# EAGLE design rx20 (EAGLE 9.1.3)
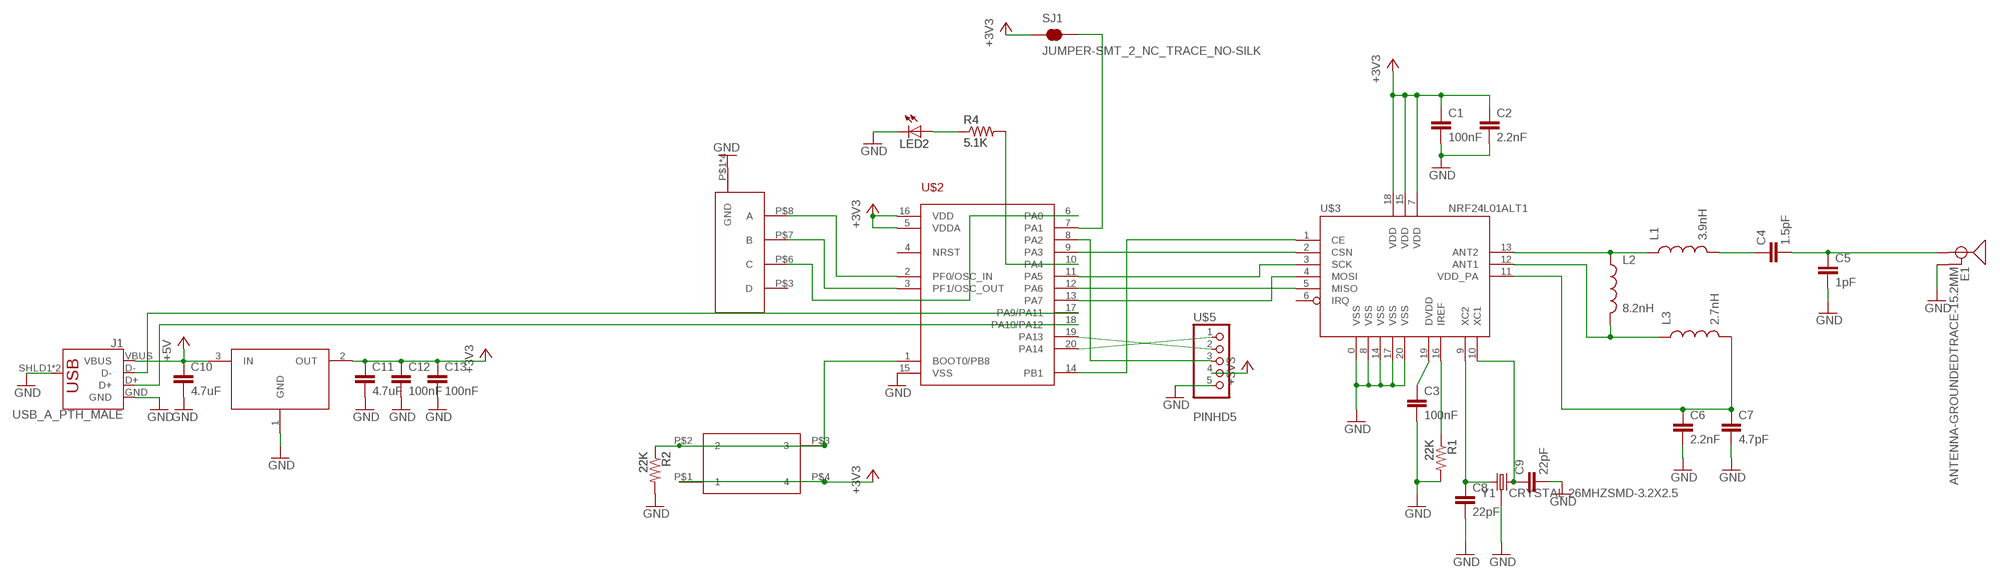
[diagram p0: schematic, sheet 1]

## Parts
C1  100nF  CAP0805  [0805]
C2  2.2nF  CAP0805  [0805]
C3  100nF  CAP0805  [0805]
C4  1.5pF  CAP0805  [0805]
C5  1pF  CAP0805  [0805]
C6  2.2nF  CAP0805  [0805]
C7  4.7pF  CAP0805  [0805]
C8  22pF  CAP0805  [0805]
C9  22pF  CAP0805  [0805]
C10  4.7uF  CAP0805  [0805]
C11  4.7uF  CAP0805  [0805]
C12  100nF  CAP0805  [0805]
C13  100nF  CAP0805  [0805]
E1  ANTENNA-GROUNDEDTRACE-15.2MM  [TRACE_ANTENNA_2.4GHZ_15.2MM]
J1  USB_A_PTH_MALE  [USB-A-H]
L1  3.9nH  INDUCTOR0805  [0805]
L2  8.2nH  INDUCTOR0805  [0805]
L3  2.7nH  INDUCTOR0805  [0805]
LED2  LEDCHIP-LED0805  [CHIP-LED0805]
R1  22K  RESISTOR0805-RES  [0805]
R2  22K  RESISTOR0805-RES  [0805]
R4  5.1K  RESISTOR0805-RES  [0805]
SJ1  JUMPER-SMT_2_NC_TRACE_NO-SILK  [SMT-JUMPER_2_NC_TRACE_NO-SILK]
U$1  SW_3POS_DEVSW_3POS_OFFICIAL  [SW_3POS_FOOT_OFFICIAL]
U$2  STM32F042F4  [TSSOP20]
U$3  NRF24L01ALT1  [QFN20_ALT1]
U$4  XC6206_DEV  [SOT23R_INFINEON]
U$5  PINHD5  [1X05]
U$10  324_SW  [342_SWICH_FOOT]
Y1  CRYSTAL-26MHZSMD-3.2X2.5  [CRYSTAL-SMD-3.2X2.5MM]

## Nets
+3V3: C1.1 C2.1 C11.1 C12.1 C13.1 SJ1.1 U$2.5(VDDA) U$2.16(VDD) U$3.7(VDD) U$3.15(VDD) U$3.18(VDD) U$4.2(OUT) U$5.4 U$10.P$1 U$10.P$4
+5V: C10.1 J1.VBUS U$4.3(IN)
GND: C1.2 C2.2 C3.2 C5.2 C6.2 C7.2 C8.2 C9.2 C10.2 C11.2 C12.2 C13.2 E1.GND J1.GND J1.SHLD1(SHIELD) J1.SHLD2(SHIELD) LED2.C R1.2 R2.2 U$1.P$1(GND) U$1.P$2(GND) U$1.P$4(GND) U$1.P$5(GND) U$2.15(VSS) U$3.0(VSS) U$3.8(VSS) U$3.14(VSS) U$3.17(VSS) U$3.20(VSS) U$4.1(GND) U$5.5 Y1.2 Y1.4
N$1: C3.1 U$3.19(DVDD)
N$2: R1.1 U$3.16(IREF)
N$3: L1.1 L2.1 U$3.13(ANT2)
N$4: C4.1 L1.2
N$5: C4.2 C5.1 E1.ANT(SIGNAL)
N$6: L2.2 L3.1 U$3.12(ANT1)
N$7: C8.1 U$3.9(XC2) Y1.1
N$8: C6.1 C7.1 L3.2 U$3.11(VDD_PA)
N$9: C9.1 U$3.10(XC1) Y1.3
N$10: U$1.P$8(A) U$2.2(PF0/OSC_IN)
N$11: R2.1 U$2.1(BOOT0/PB8) U$10.P$2 U$10.P$3
N$12: J1.D- U$2.17(PA9/PA11)
N$13: J1.D+ U$2.18(PA10/PA12)
N$14: U$2.12(PA6) U$3.5(MISO)
N$15: U$2.13(PA7) U$3.4(MOSI)
N$16: U$2.11(PA5) U$3.3(SCK)
N$17: U$2.19(PA13) U$5.2
N$18: LED2.A R4.1
N$19: SJ1.2 U$2.7(PA1)
N$20: U$2.20(PA14) U$5.1
N$21: U$2.8(PA2) U$5.3
N$22: U$2.14(PB1) U$3.1(CE)
N$23: R4.2 U$2.10(PA4)
N$24: U$2.9(PA3) U$3.2(CSN)
N$25: U$1.P$7(B) U$2.3(PF1/OSC_OUT)
N$26: U$1.P$6(C) U$2.6(PA0)
Unconnected: U$1.P$3(D) U$2.4(NRST) U$3.6(IRQ)

## Library data of the parts
C1-C13 = clock:CAP: Capacitor Standard 0603 ceramic capacitor, and 0.1" leaded capacitor.
E1 = SparkFun-RF:ANTENNA-GROUNDED: Antenna w/ Ground Connection 2.4GHz antennae with signal and ground terminals. TRACE_ANTENNA_2.4GHZ_15.2MM - Meander Trace antenna 15.2 x 5.7mm footprint Based on layout from TI app note AN043 <http://www.ti.com/lit/an/swra117d/swra117d.pdf>. TRACE_ANTENNA_2.4GHZ_25.7MM - Inverted F trace antenna 25.7 x 7.5 mm footprint. Based on layout from TI design note DN0007 <http://www.ti.com/lit/an/swru120b/swru120b.pdf>.
J1 = rx20:USB_A: USB-A Connector Male and female variants, as well as PTH and SMT variants SparkFun Products: SparkFun XBee Explorer Dongle <https://www.sparkfun.com/products/11697> PTH Male SparkFun MicroView-USB Programmer <https://www.sparkfun.com/products/12924> SMT Male SparkFun USB Type A Female Breakout <https://www.sparkfun.com/products/12700> SMT Female; PROD_ID: CONN-08367; SF_ID: PRT-00437
L1-L3 = basicBoard:INDUCTOR: Inductors Basic Inductor/Choke - 0603 and 1206. Footprints are not proven and vary greatly between part numbers. INDUCTOR POWER 3.3UH 4.0A SMD 0.197" L x 0.197" W x 0.177" H (5.00mm x 5.00mm x 4.50mm)
LED2 = joyAnalog:LED: LED OSRAM: - CHIPLED LG R971, LG N971, LY N971, LG Q971, LY Q971, LO R971, LY R971 LH N974, LH R974 LS Q976, LO Q976, LY Q976 LO Q996 - Hyper CHIPLED LW Q18S LB Q993, LB Q99A, LB R99A - SideLED LS A670, LO A670, LY A670, LG A670, LP A670 LB A673, LV A673, LT A673, LW A673 LH A674 LY A675 LS A676, LA A676, LO A676, LY A676, LW A676 LS A679, LY A679, LG A679 - Hyper Micro SIDELED® LS Y876, LA Y876, LO Y876, LY Y876 LT Y87S - SmartLED LW L88C, LW L88S LB L89C, LB L89S, LG L890 LS L89K, LO L89K, LY L89K LS L896, LA L896, LO L896, LY L896 - TOPLED LS T670, LO T670, LY T670, LG T670, LP T670 LSG T670, LSP T670, LSY T670, LOP T670, LYG T670 LG T671, LOG T671, LSG T671 LB T673, LV T673, LT T673, LW T673 LH T674 LS T676, LA T676, LO T676, LY T676, LB T676, LH T676, LSB T676, LW T676 LB T67C, LV T67C, LT T67C, LS T67K, LO T67K, LY T67K, LW E67C LS E67B, LA E67B, LO E67B, LY E67B, LB E67C, LV E67C, LT E67C LW T67C LS T679, LY T679, LG T679 LS T770, LO T770, LY T770, LG T770, LP T770 LB T773, LV T773, LT T773, LW T773 LH T774 LS E675, LA E675, LY E675, LS T675 LS T776, LA T776, LO T776, LY T776, LB T776 LHGB T686 LT T68C, LB T68C - Hyper Mini TOPLED® LB M676 - Mini TOPLED Santana® LG M470 LS M47K, LO M47K, LY M47K Source: http://www.osram.convergy.de/
R1 R2 R4 = joyAnalog:RESISTOR: Resistor Basic schematic elements and footprints for 0603, 1206, and PTH resistors.
SJ1 = SparkFun-Jumpers:JUMPER-SMT_2_NC_TRACE: Normally closed trace jumper This jumper has a trace between two pads so it's normally closed (NC). Use a razor knife to open the connection. For best results follow the IPC guidelines for cutting traces: Cutout at least 0.063 mm (0.005 in). Remove all loose material to clean up the cut area. Seal the cut with an approved epoxy. Reapply solder to reclose the connection.
U$1 = 3pos_slide_switch:SW_3POS_DEV
U$2 = tx:STM32F042F4
U$3 = nRF24L01-Chip-v13:NRF24L01: 2.4GHz Low Power Transceiver This is the very popular, low cost, very low power RF transceiver from Nordic Semiconductor. Simple SPI interface. SKU: COM-00690
U$4 = 3pos_slide_switch:XC6206_DEV
U$5 = adafruit_changed:PINHD5
U$10 = 3pos_slide_switch:324_SW
Y1 = SparkFun-Clocks:CRYSTAL-26MHZ: 26MHz Crystal w/ Ground Pin Digikey Example <http://www.digikey.com/product-detail/en/epson/TSX-3225%2026.0000MF09Z-AC3/SER3627CT-ND/1802878> Frequency: 26MHz Frequency Stability: ±9ppm Frequency Tolerance: ±10ppm Load Capacitance: 9pF SparkFun Products: SparkFun ESP32 Thing <https://www.sparkfun.com/products/13907> SparkFun ESP8266 Thing Dev Board <https://www.sparkfun.com/products/13711>; PROD_ID: XTAL-12454

## Board
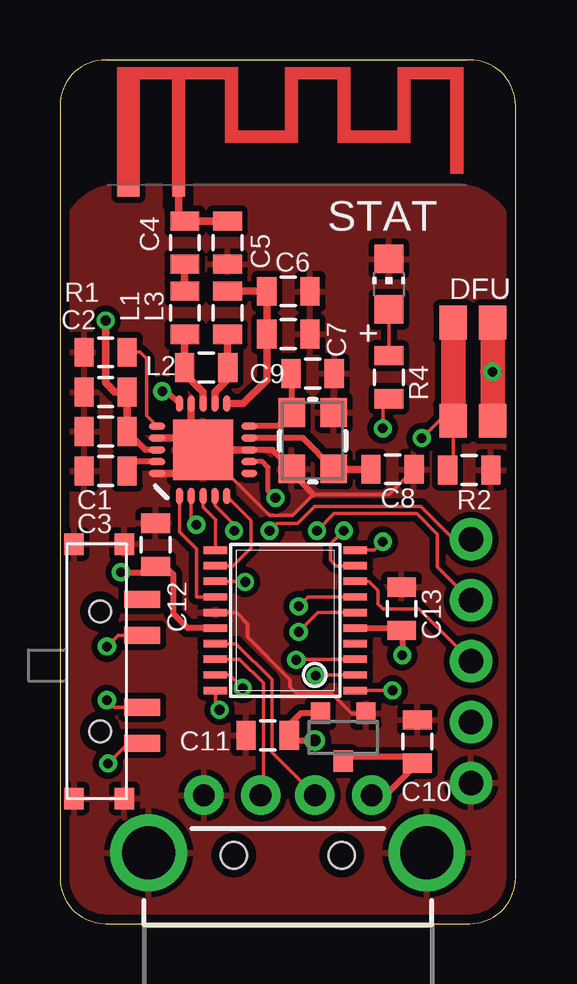
[diagram p1: board, top side]
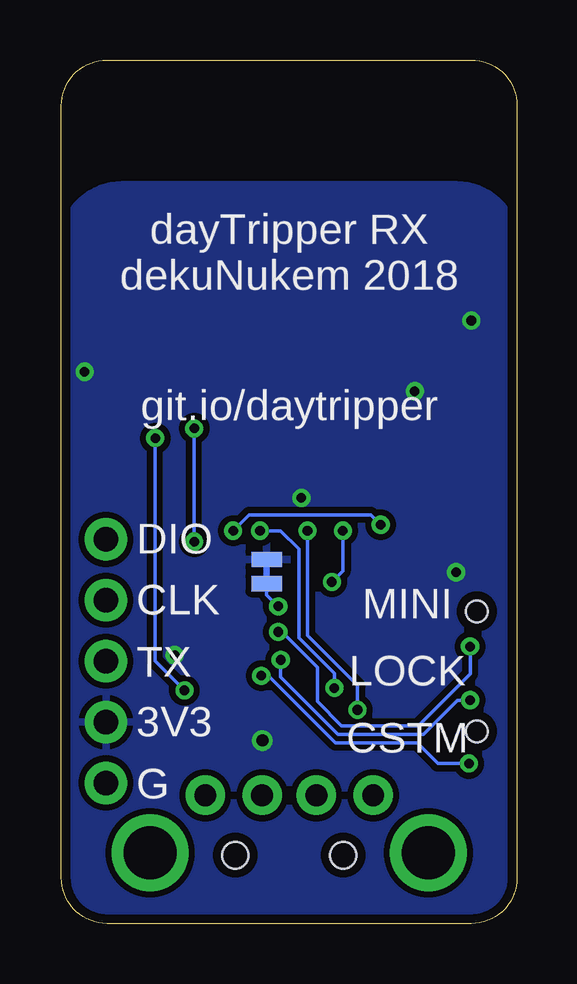
[diagram p2: board, bottom side, seen from below]

Size 19 x 36 mm. Coordinates in mm from the lower left corner, seen from the top.
Outline: 0,34.09 0,1.91 arc90 1.91,0 17.09,0 arc90 19,1.91 19,34.09 arc90 17.09,36 1.91,36 arc90 0,34.09
Copper layers (1*16): Top 0.035mm / dielectric 1.5mm / Bottom 0.035mm
Design rules "SparkFun-2-layer-TIGHT *": minimum track width 6mil, minimum drill 15mil, track to track 6mil, track to pad 6mil, pad to pad 6mil, via to via 6mil, smd to smd 6mil, copper to edge 15mil, drill to drill 6mil, minimum pad ring 7mil, minimum via ring 7mil, stop-mask expansion 4mil, vias tented up to drill 25mil, thermal gap 10mil
tRestrict: area 4.6,29.8 to 5.2,31

### Footprints (pad centres in the part's own frame; a part is rotated, then mirrored left to right if it is on the bottom)
0805 = smd 0.8 x 1.2: 1 -0.9,0; 2 0.9,0
TRACE_ANTENNA_2.4GHZ_15.2MM = smd 0.5 x 0.5: ANT 0,-0.25 | smd 0.9 x 0.5: GND -2.1,-0.25
USB-A-H = drill 0.914 pad 1.651: D+ 2.4,1.127; D- 2.4,-1.127; GND 2.4,3.5; VBUS 2.4,-3.5 | drill 2.2: SHLD1 0,-5.8; SHLD2 0,5.8 | hole 1.1: -0.1,2.25; -0.1,-2.25
CHIP-LED0805 = smd 1.2 x 1.2: A 0,-1.05; C 0,1.05
SMT-JUMPER_2_NC_TRACE_NO-SILK = smd 0.635 x 1.27: 1 -0.508,0; 2 0.508,0
SW_3POS_FOOT_OFFICIAL = smd 0.9 x 0.8: P$1 0,0; P$2 0,2.1; P$4 10.6,2.1; P$5 10.6,0 | smd 0.7 x 1.5: P$3 2.3,2.85; P$6 3.8,2.85; P$7 6.8,2.85; P$8 8.3,2.85 | hole 0.9: 2.8,1.1; 7.8,1.1
TSSOP20 = smd 0.305 x 0.991: 1 -2.925,-2.918; 2 -2.275,-2.918; 3 -1.625,-2.918; 4 -0.975,-2.918; 5 -0.325,-2.918; 6 0.325,-2.918; 7 0.975,-2.918; 8 1.625,-2.918; 9 2.275,-2.918; 10 2.925,-2.918; 11 2.925,2.918; 12 2.275,2.918; 13 1.625,2.918; 14 0.975,2.918; 15 0.325,2.918; 16 -0.325,2.918; 17 -0.975,2.918; 18 -1.625,2.918; 19 -2.275,2.918; 20 -2.925,2.918
QFN20_ALT1 = smd 2.515 x 2.515: 0 0,0 | smd 0.686 x 0.293: 1 -1.925,0.986; 2 -1.925,0.493; 3 -1.925,0; 4 -1.925,-0.493; 5 -1.925,-0.986; 11 1.925,-0.986; 12 1.925,-0.493; 13 1.925,0; 14 1.925,0.493; 15 1.925,0.986 | smd 0.293 x 0.686: 6 -0.986,-1.925; 7 -0.493,-1.925; 8 0,-1.925; 9 0.493,-1.925; 10 0.986,-1.925; 16 0.986,1.925; 17 0.493,1.925; 18 0,1.925; 19 -0.493,1.925; 20 -0.986,1.925
SOT23R_INFINEON = smd 0.8 x 0.9: 1 -0.95,-1; 2 0.95,-1; 3 0,1
1X05 = drill 1.016 pad 1.778: 1 -6.35,0; 2 -3.81,0; 3 -1.27,0; 4 1.27,0; 5 3.81,0
342_SWICH_FOOT = smd 1.4 x 1.15: P$1 -2.05,-0.825; P$2 -2.05,0.825; P$3 2.05,0.825; P$4 2.05,-0.825
CRYSTAL-SMD-3.2X2.5MM = smd 1.2 x 1.1: 1 -1.175,-0.875; 2 1.175,-0.875; 3 1.175,0.875; 4 -1.175,0.875

### Placement (x,y rotation side)
C1  1.91,20.51 180 top
C2  1.91,22.16 180 top
C3  1.91,18.86 180 top
C4  5.21,28.39 90 top
C5  6.99,28.39 270 top
C6  9.53,26.35 0 top
C7  9.53,24.57 0 top
C8  13.87,18.94 0 top
C9  10.54,22.92 0 top
C10  14.91,7.59 90 top
C11  8.66,7.84 180 top
C12  3.99,15.79 90 top
C13  14.25,13.12 90 top
E1  4.95,30.8 0 top
J1  9.5,2.95 90 top
L1  5.21,25.46 90 top
L2  6.1,23.18 0 top
L3  6.99,25.46 90 top
LED2  13.72,26.66 0 top
R1  1.91,23.81 180 top
R2  17.07,18.91 0 top
R4  13.72,22.77 270 top
SJ1  10.44,14.67 270 bottom
U$1  0.58,15.81 270 top
U$2  9.4,12.64 90 top
U$3  5.97,19.75 90 top
U$4  11.81,7.76 180 top
U$5  17.14,9.67 270 top
U$10  17.22,23 90 top
Y1  10.54,20.13 90 top

### Tracks (layer width: path | path; a pad name or v marks a point on that pad's centre or on a via)
+3V3  (via drill 0.4, 0.5)
  Top 0.203: U$3.7 8.44,19.26 8.69,19.01 8.69,18.05 v8.99,17.74
  Top 0.254: U$3.15 4.47,22.19 v4.27,22.19 | U$3.18 3.57,19.75 C1.1 | U$2.16 5.33,12.31 4.72,12.92 4.72,14.56 4.39,14.89 C12.1 3.74,14.64 v2.54,14.64 | v14.28,11.19 14.28,12.2 C13.1 14.16,12.31 U$2.5 | U$4.2 10.03,8.76 9.56,8.29 C11.1 9.77,7.63 v10.62,7.63
  Top 0.305: C1.1 C2.1 2.29,22.16 1.91,22.54 v1.91,25.13
  Top 1.016: U$10.P$4 18.05,23.01 | 18.05,23.01 v18.03,23 | U$10.P$1 18.05,23.01
  pour Bottom (isolate 0.254): 19,0 19,28.26 arc90 16.46,30.8 2.54,30.8 arc90 0,28.26 0,0
+5V
  Top 0.254: U$4.3 12.01,6.96 14.63,6.96 C10.1 13.57,5.35 J1.VBUS
GND
  Top 0.152: C8.2 13.73,17.89 10.57,17.89 9.69,17.02 8.74,17.02 6.25,19.51 5.97,19.51 | 9.67,18.8 Y1.4 | U$4.1 12.17,8.76 11.33,9.6 9.86,9.6 9.6,9.86 9.6,10.16 7.82,11.94 7.82,12.5 7.36,12.96 U$2.15
  Top 0.254: Y1.4 8.87,19.75 8.56,19.75 U$3.8 | 10.57,17.89 9.67,18.8
  Top 0.305: U$3.8 7.37,19.75 U$3.0 | U$3.0 5.48,19.75 5.48,20.26 | 5.48,20.26 U$3.14 | U$3.17 5.48,20.24 5.48,20.26 | U$3.20 5.97,18.76 5.97,19.51 U$3.0
  pour Top (isolate 0.254): 19,0 19,28.26 arc90 16.46,30.8 2.54,30.8 arc90 0,28.26 0,0
N$1
  Top 0.254: U$3.19 3.2,19.26 C3.1
N$2
  Top 0.152: R1.1 3.35,23.81 3.61,23.56 3.61,21.17 U$3.16
N$3
  Top 0.305: U$3.13 5.97,22.16 5.2,22.93 L2.1 L1.1
N$4
  Top 0.305: L1.2 C4.1
N$5
  Top 0.305: C5.1 C4.2 4.95,29.54 E1.ANT
N$6
  Top 0.305: U$3.12 6.46,22.15 7,22.68 L2.2 6.99,23.19 L3.1
N$7
  Top 0.254: U$3.9 10.13,20.24 Y1.1 11.45,18.99
  Top 0.305: C8.1 11.5,18.94 11.45,18.99
N$8
  Top 0.305: L3.2 8.61,26.36 C6.1 C7.1 8.62,22.66 7.64,21.67 U$3.11
N$9
  Top 0.254: U$3.10 9.1,20.73 Y1.3 9.67,22.9 C9.1
N$10  (via drill 0.4)
  Top 0.152: v10.67,10.33 10.7,10.37 U$2.2 | v2.01,6.67 2.85,7.51 U$1.P$8
  Bottom 0.152: v2.01,6.67 3.3,6.67 4.17,7.53 7.57,7.53 10.36,10.33 v10.67,10.33
N$11  (via drill 0.4)
  Top 0.152: U$2.1 v13.86,9.71 v13.87,9.72 | v15.09,20.23 15.8,20.95 U$10.P$2 16.4,19.14 R2.1
  Top 1.016: U$10.P$3 U$10.P$2
  Bottom 0.152: v13.87,9.72 15.09,10.94 v15.09,20.23
N$12
  Top 0.152: U$2.17 7.35,11.66 8.84,10.18 8.84,7.14 J1.D-
N$13
  Top 0.152: U$2.18 7.49,11.02 8.48,10.02 8.48,5.46 J1.D+
N$14
  Top 0.152: U$3.5 7.98,16.8 7.98,15.66 7.23,14.91 U$2.12
N$15  (via drill 0.4)
  Top 0.152: U$2.13 7.7,14.27 v7.72,14.24 | U$3.4 6.46,17.43 7.26,16.63 v7.26,16.37
  Bottom 0.152: v7.26,16.37 7.26,14.7 v7.72,14.24
N$16
  Top 0.152: U$3.3 5.97,17.36 6.48,16.85 U$2.11
N$17  (via drill 0.4)
  Top 0.152: U$2.19 7.08,10.37 v7.62,9.82 | v10.72,16.37 11.43,17.09 14.88,17.09 15.75,16.22 15.75,14.88 U$5.2
  Bottom 0.152: v7.62,9.82 7.62,10.43 9.09,11.9 9.09,15.61 9.86,16.37 v10.72,16.37
N$18
  Top 0.152: LED2.A R4.1
N$19  (via drill 0.4)
  Top 0.152: U$2.7 10.35,13.62 v9.96,13.22
  Bottom 0.152: v9.96,13.22 10.44,13.71 SJ1.2
N$20  (via drill 0.4)
  Top 0.152: U$2.20 6.48,9.08 v6.66,8.91 | v8.74,16.37 9.04,16.68 9.91,16.68 10.62,17.39 15.06,17.39 16.43,16.02 U$5.1
  Bottom 0.152: v6.66,8.91 6.66,9.92 8.74,12.01 v8.74,16.37
N$21
  Top 0.152: U$2.8 12.88,14.27 13.26,13.88 13.26,13.33 13.46,13.12 14.96,13.12 U$5.3
N$22
  Top 0.152: U$2.14 5.69,13.62 5.69,15.61 4.98,16.32 U$3.1
N$23  (via drill 0.4)
  Top 0.152: v13.46,20.64 13.46,21.62 R4.2 | U$2.10 13.11,15.56 v13.46,15.92
  Bottom 0.152: v13.46,15.92 v13.46,20.64
N$24  (via drill 0.4)
  Top 0.152: v11.84,16.37 11.28,15.81 11.28,15.15 11.52,14.91 U$2.9 | U$3.2 5.48,16.84 v5.69,16.63
  Bottom 0.152: v5.69,16.63 6.1,17.03 11.18,17.03 v11.84,16.37
N$25  (via drill 0.4)
  Top 0.152: U$1.P$7 2.25,9.02 v1.96,9.31 | U$2.3 9.88,11.02 v9.86,10.99
  Bottom 0.152: v1.96,9.31 2.49,9.31 3.91,7.89 7.47,7.89 9.86,10.28 v9.86,10.99
N$26  (via drill 0.4)
  Top 0.152: v9.96,12.16 10.76,12.96 U$2.6 | U$1.P$6 2.42,12.02 v1.96,11.55
  Bottom 0.152: v9.96,12.16 9.8,12.16 8.33,10.68 8.33,9.26 7.32,8.25 4.12,8.25 1.96,10.41 v1.96,11.55

### Text on the board
tNames: STAT | DFU
bNames: dayTripper RX / dekuNukem 2018 | git.io/daytripper | DIO | MINI | CLK | LOCK | TX | CSTM | 3V3 | G